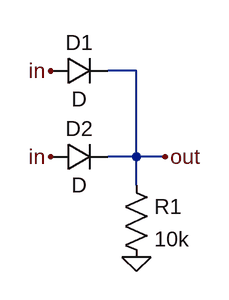
[diagram p0: schematic Max.asc]
Max.asc, the LTspice schematic file:
Version 4
SHEET 1 880 680
WIRE 160 80 128 80
WIRE 160 176 160 80
WIRE 160 176 128 176
WIRE 192 176 160 176
WIRE 160 208 160 176
FLAG 160 288 0
FLAG 64 80 in
FLAG 64 176 in
FLAG 192 176 out
SYMBOL diode 64 96 R270
WINDOW 0 32 32 VTop 2
WINDOW 3 0 32 VBottom 2
SYMATTR InstName D1
SYMBOL diode 64 192 R270
WINDOW 0 32 32 VTop 2
WINDOW 3 0 32 VBottom 2
SYMATTR InstName D2
SYMBOL res 144 192 R0
SYMATTR InstName R1
SYMATTR Value 10k

The netlist it stands for:
* Max.asc
D1 in out D
D2 in out D
R1 out 0 10k
.model D D
.lib standard.dio
.backanno
.end